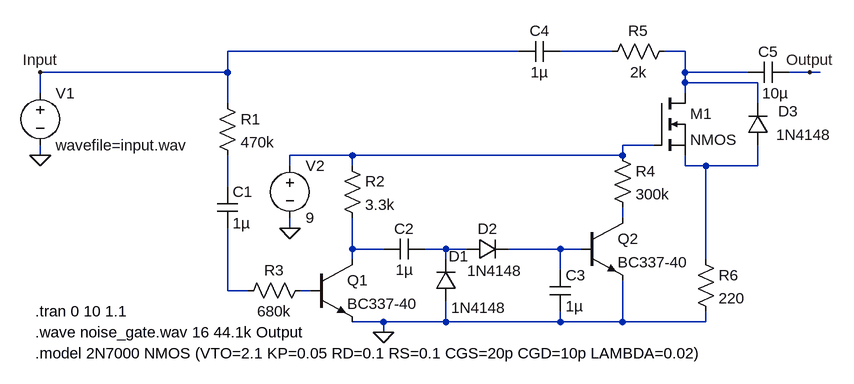
[diagram p0: schematic noise_gate.asc]
noise_gate.asc, the LTspice schematic file:
Version 4
SHEET 1 880 680
WIRE -64 -2096 -512 -2096
WIRE 80 -2096 0 -2096
WIRE 192 -2096 160 -2096
WIRE -512 -2064 -512 -2096
WIRE -512 -2064 -800 -2064
WIRE 192 -2064 192 -2096
WIRE 288 -2064 192 -2064
WIRE 384 -2064 352 -2064
WIRE 400 -2064 384 -2064
WIRE 192 -2048 192 -2064
WIRE 304 -2048 192 -2048
WIRE -800 -2032 -800 -2064
WIRE 192 -2032 192 -2048
WIRE -512 -2016 -512 -2064
WIRE 304 -2016 304 -2048
WIRE 144 -1952 96 -1952
WIRE -800 -1936 -800 -1952
WIRE -320 -1936 -416 -1936
WIRE 96 -1936 96 -1952
WIRE 96 -1936 -320 -1936
WIRE -416 -1920 -416 -1936
WIRE -320 -1920 -320 -1936
WIRE 192 -1920 192 -1936
WIRE 224 -1920 192 -1920
WIRE 304 -1920 304 -1952
WIRE 304 -1920 224 -1920
WIRE -512 -1888 -512 -1936
WIRE 96 -1840 96 -1856
WIRE -416 -1824 -416 -1840
WIRE -320 -1792 -320 -1840
WIRE -272 -1792 -320 -1792
WIRE -176 -1792 -208 -1792
WIRE -144 -1792 -176 -1792
WIRE 0 -1792 -80 -1792
WIRE 32 -1792 0 -1792
WIRE -320 -1776 -320 -1792
WIRE -176 -1776 -176 -1792
WIRE 224 -1776 224 -1920
WIRE 0 -1760 0 -1792
WIRE -512 -1728 -512 -1824
WIRE -480 -1728 -512 -1728
WIRE -384 -1728 -400 -1728
WIRE -272 -1680 -320 -1680
WIRE -176 -1680 -176 -1712
WIRE -176 -1680 -272 -1680
WIRE 0 -1680 0 -1696
WIRE 0 -1680 -176 -1680
WIRE 96 -1680 96 -1744
WIRE 96 -1680 0 -1680
WIRE 224 -1680 224 -1696
WIRE 224 -1680 96 -1680
WIRE -272 -1664 -272 -1680
FLAG -800 -1936 0
FLAG -800 -2064 Input
FLAG 384 -2064 Output
FLAG -416 -1824 0
FLAG -272 -1664 0
SYMBOL npn -384 -1776 R0
SYMATTR InstName Q1
SYMATTR Value BC337-40
SYMBOL voltage -800 -2048 R0
SYMATTR InstName V1
SYMATTR Value wavefile=input.wav
SYMBOL res -528 -2032 R0
SYMATTR InstName R1
SYMATTR Value 470k
SYMBOL cap -528 -1888 R0
SYMATTR InstName C1
SYMATTR Value 1µ
SYMBOL voltage -416 -1936 R0
WINDOW 123 0 0 Left 0
WINDOW 39 0 0 Left 0
SYMATTR InstName V2
SYMATTR Value 9
SYMBOL res -336 -1936 R0
SYMATTR InstName R2
SYMATTR Value 3.3k
SYMBOL res -384 -1744 R90
WINDOW 0 0 56 VBottom 2
WINDOW 3 32 56 VTop 2
SYMATTR InstName R3
SYMATTR Value 680k
SYMBOL diode -160 -1712 R180
WINDOW 0 -19 69 Left 2
WINDOW 3 -77 -10 Left 2
SYMATTR InstName D1
SYMATTR Value 1N4148
SYMBOL diode -144 -1776 R270
WINDOW 0 32 32 VTop 2
WINDOW 3 -2 43 VBottom 2
SYMATTR InstName D2
SYMATTR Value 1N4148
SYMBOL cap -208 -1808 R90
WINDOW 0 0 32 VBottom 2
WINDOW 3 32 32 VTop 2
SYMATTR InstName C2
SYMATTR Value 1µ
SYMBOL cap -16 -1760 R0
SYMATTR InstName C3
SYMATTR Value 1µ
SYMBOL npn 32 -1840 R0
SYMATTR InstName Q2
SYMATTR Value BC337-40
SYMBOL res 80 -1952 R0
SYMATTR InstName R4
SYMATTR Value 300k
SYMBOL diode 320 -1952 R180
WINDOW 0 -46 52 Left 2
WINDOW 3 -97 16 Left 2
SYMATTR InstName D3
SYMATTR Value 1N4148
SYMBOL res 176 -2112 R90
WINDOW 0 0 56 VBottom 2
WINDOW 3 32 56 VTop 2
SYMATTR InstName R5
SYMATTR Value 2k
SYMBOL cap 0 -2112 R90
WINDOW 0 0 32 VBottom 2
WINDOW 3 32 32 VTop 2
SYMATTR InstName C4
SYMATTR Value 1µ
SYMBOL cap 352 -2080 R90
WINDOW 0 0 32 VBottom 2
WINDOW 3 33 21 VTop 2
SYMATTR InstName C5
SYMATTR Value 10µ
SYMBOL res 208 -1792 R0
SYMATTR InstName R6
SYMATTR Value 220
SYMBOL nmos 144 -2032 R0
SYMATTR InstName M1
TEXT -808 -1664 Left 2 !.wave noise_gate.wav 16 44.1k Output
TEXT -808 -1696 Left 2 !.tran 0 10 1.1
TEXT -808 -1632 Left 2 !.model 2N7000 NMOS (VTO=2.1 KP=0.05 RD=0.1 RS=0.1 CGS=20p CGD=10p LAMBDA=0.02)

The netlist it stands for:
* noise_gate.asc
Q1 N007 N011 0 0 BC337-40
V1 Input 0 wavefile=input.wav
R1 Input N005 470k
C1 N005 N010 1µ
V2 N003 0 9
R2 N003 N007 3.3k
R3 N011 N010 680k
D1 0 N008 1N4148
D2 N008 N009 1N4148
C2 N008 N007 1µ
C3 N009 0 1µ
Q2 N006 N009 0 0 BC337-40
R4 N003 N006 300k
D3 N004 N002 1N4148
R5 N002 N001 2k
C4 N001 Input 1µ
C5 Output N002 10µ
R6 N004 0 220
M1 N002 N003 N004 N004 NMOS
.model D D
.lib standard.dio
.model NPN NPN
.model PNP PNP
.lib standard.bjt
.model NMOS NMOS
.model PMOS PMOS
.lib standard.mos
.wave noise_gate.wav 16 44.1k Output
.tran 0 10 1.1
.model 2N7000 NMOS (VTO=2.1 KP=0.05 RD=0.1 RS=0.1 CGS=20p CGD=10p LAMBDA=0.02)
.backanno
.end